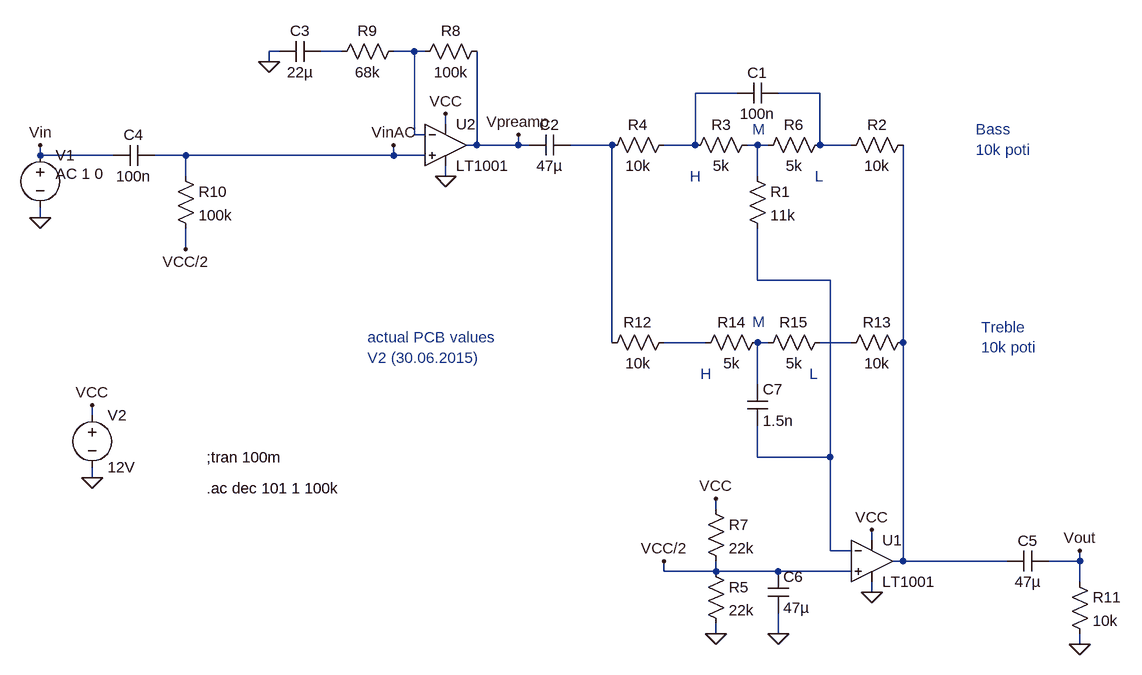
[diagram p0: schematic preampv2.asc]
preampv2.asc, the LTspice schematic file:
Version 4
SHEET 1 984 996
WIRE -496 48 -512 48
WIRE -400 48 -432 48
WIRE -288 48 -320 48
WIRE -272 48 -288 48
WIRE -512 64 -512 48
WIRE 208 112 144 112
WIRE 336 112 272 112
WIRE -240 160 -240 144
WIRE -288 176 -288 48
WIRE -272 176 -288 176
WIRE -192 192 -192 48
WIRE -192 192 -208 192
WIRE -128 192 -128 176
WIRE -128 192 -192 192
WIRE -112 192 -128 192
WIRE 16 192 -48 192
WIRE 144 192 144 112
WIRE 144 192 96 192
WIRE 240 192 224 192
WIRE 256 192 240 192
WIRE 336 192 336 112
WIRE 384 192 336 192
WIRE -864 208 -864 192
WIRE -752 208 -864 208
WIRE -640 208 -688 208
WIRE -320 208 -320 192
WIRE -320 208 -640 208
WIRE -272 208 -320 208
WIRE -640 240 -640 208
WIRE -240 240 -240 224
WIRE 240 240 240 192
WIRE -864 304 -864 288
WIRE -640 352 -640 320
WIRE 240 400 240 320
WIRE 352 400 240 400
WIRE 16 496 16 192
WIRE 160 496 96 496
WIRE 256 496 240 496
WIRE 384 496 336 496
WIRE 464 496 464 192
WIRE 240 560 240 496
WIRE -784 608 -784 592
WIRE 240 672 240 624
WIRE 352 672 352 400
WIRE 352 672 240 672
WIRE -784 704 -784 688
WIRE 176 752 176 736
WIRE 416 800 416 784
WIRE 352 816 352 672
WIRE 384 816 352 816
WIRE 464 832 464 496
WIRE 464 832 448 832
WIRE 624 832 464 832
WIRE 736 832 736 816
WIRE 736 832 688 832
WIRE 96 848 96 832
WIRE 176 848 176 832
WIRE 176 848 96 848
WIRE 272 848 176 848
WIRE 384 848 272 848
WIRE 736 864 736 832
WIRE 416 880 416 864
WIRE 176 944 176 928
WIRE 272 944 272 912
WIRE 736 960 736 944
FLAG 176 944 0
FLAG 176 736 VCC
FLAG 416 784 VCC
FLAG 416 880 0
FLAG -784 704 0
FLAG -784 592 VCC
FLAG -240 240 0
FLAG -240 144 VCC
FLAG -512 64 0
FLAG 96 832 VCC/2
FLAG -640 352 VCC/2
FLAG -864 304 0
FLAG 736 960 0
FLAG 736 816 Vout
FLAG -864 192 Vin
FLAG -128 176 Vpreamp
FLAG 272 944 0
FLAG -320 192 VinAC
SYMBOL cap 272 96 R90
WINDOW 0 0 32 VBottom 2
WINDOW 3 32 32 VTop 2
SYMATTR InstName C1
SYMATTR Value 100n
SYMBOL cap -48 176 R90
WINDOW 0 0 32 VBottom 2
WINDOW 3 32 32 VTop 2
SYMATTR InstName C2
SYMATTR Value 47µ
SYMBOL res 480 176 R90
WINDOW 0 0 56 VBottom 2
WINDOW 3 32 56 VTop 2
SYMATTR InstName R2
SYMATTR Value 10k
SYMBOL res 240 176 R90
WINDOW 0 0 56 VBottom 2
WINDOW 3 32 56 VTop 2
SYMATTR InstName R3
SYMATTR Value 5k
SYMBOL res 112 176 R90
WINDOW 0 0 56 VBottom 2
WINDOW 3 32 56 VTop 2
SYMATTR InstName R4
SYMATTR Value 10k
SYMBOL res 224 224 R0
SYMATTR InstName R1
SYMATTR Value 11k
SYMBOL Opamps\\LT1001 416 768 R0
SYMATTR InstName U1
SYMBOL res 160 832 R0
SYMATTR InstName R5
SYMATTR Value 22k
SYMBOL res 160 736 R0
SYMATTR InstName R7
SYMATTR Value 22k
SYMBOL voltage -864 192 R0
WINDOW 3 24 96 Invisible 2
WINDOW 123 24 44 Left 2
WINDOW 39 0 0 Left 2
SYMATTR Value SINE(0 1 100)
SYMATTR Value2 AC 1 0
SYMATTR InstName V1
SYMBOL voltage -784 592 R0
WINDOW 123 0 0 Left 2
WINDOW 39 0 0 Left 2
SYMATTR InstName V2
SYMATTR Value 12V
SYMBOL Opamps\\LT1001 -240 128 R0
SYMATTR InstName U2
SYMBOL res -176 32 R90
WINDOW 0 0 56 VBottom 2
WINDOW 3 32 56 VTop 2
SYMATTR InstName R8
SYMATTR Value 100k
SYMBOL res -304 32 R90
WINDOW 0 0 56 VBottom 2
WINDOW 3 32 56 VTop 2
SYMATTR InstName R9
SYMATTR Value 68k
SYMBOL cap -432 32 R90
WINDOW 0 0 32 VBottom 2
WINDOW 3 32 32 VTop 2
SYMATTR InstName C3
SYMATTR Value 22µ
SYMBOL cap -688 192 R90
WINDOW 0 0 32 VBottom 2
WINDOW 3 32 32 VTop 2
SYMATTR InstName C4
SYMATTR Value 100n
SYMBOL res -656 224 R0
SYMATTR InstName R10
SYMATTR Value 100k
SYMBOL cap 688 816 R90
WINDOW 0 0 32 VBottom 2
WINDOW 3 32 32 VTop 2
SYMATTR InstName C5
SYMATTR Value 47µ
SYMBOL res 720 848 R0
SYMATTR InstName R11
SYMATTR Value 10k
SYMBOL res 352 176 R90
WINDOW 0 0 56 VBottom 2
WINDOW 3 32 56 VTop 2
SYMATTR InstName R6
SYMATTR Value 5k
SYMBOL cap 256 848 R0
SYMATTR InstName C6
SYMATTR Value 47µ
SYMBOL res 112 480 R90
WINDOW 0 0 56 VBottom 2
WINDOW 3 32 56 VTop 2
SYMATTR InstName R12
SYMATTR Value 10k
SYMBOL res 480 480 R90
WINDOW 0 0 56 VBottom 2
WINDOW 3 32 56 VTop 2
SYMATTR InstName R13
SYMATTR Value 10k
SYMBOL res 256 480 R90
WINDOW 0 0 56 VBottom 2
WINDOW 3 32 56 VTop 2
SYMATTR InstName R14
SYMATTR Value 5k
SYMBOL res 352 480 R90
WINDOW 0 0 56 VBottom 2
WINDOW 3 32 56 VTop 2
SYMATTR InstName R15
SYMATTR Value 5k
SYMBOL cap 224 560 R0
SYMATTR InstName C7
SYMATTR Value 1.5n
TEXT -608 672 Left 2 !;tran 100m
TEXT 576 168 Left 2 ;Bass\n10k poti
TEXT 584 472 Left 2 ;Treble\n10k poti
TEXT -608 720 Left 2 !.ac dec 101 1 100k
TEXT 136 240 Left 2 ;H
TEXT 328 240 Left 2 ;L
TEXT 152 544 Left 2 ;H
TEXT 320 544 Left 2 ;L
TEXT 232 168 Left 2 ;M
TEXT 232 464 Left 2 ;M
TEXT -360 488 Left 2 ;actual PCB values\nV2 (30.06.2015)

The netlist it stands for:
* preampv2.asc
C1 N004 N003 100n
C2 N005 Vpreamp 47µ
R2 N011 N004 10k
R3 N006 N003 5k
R4 N003 N005 10k
R1 N006 N007 11k
XU1 VCC/2 N007 VCC 0 N011 LT1001  ; pins In+ In- V+ V- OUT
R5 VCC/2 0 22k
R7 VCC VCC/2 22k
V1 Vin 0 SINE(0 1 100) AC 1 0
V2 VCC 0 12V
XU2 VinAC N002 VCC 0 Vpreamp LT1001  ; pins In+ In- V+ V- OUT
R8 Vpreamp N002 100k
R9 N002 N001 68k
C3 N001 0 22µ
C4 VinAC Vin 100n
R10 VinAC VCC/2 100k
C5 Vout N011 47µ
R11 Vout 0 10k
R6 N004 N006 5k
C6 VCC/2 0 47µ
R12 N008 N005 10k
R13 N011 N010 10k
R14 N009 N008 5k
R15 N010 N009 5k
C7 N009 N007 1.5n
;tran 100m
* Bass
* 10k poti
* Treble
* 10k poti
.ac dec 101 1 100k
* H
* L
* H
* L
* M
* M
* actual PCB values
* V2 (30.06.2015)
.lib LTC.lib
.backanno
.end